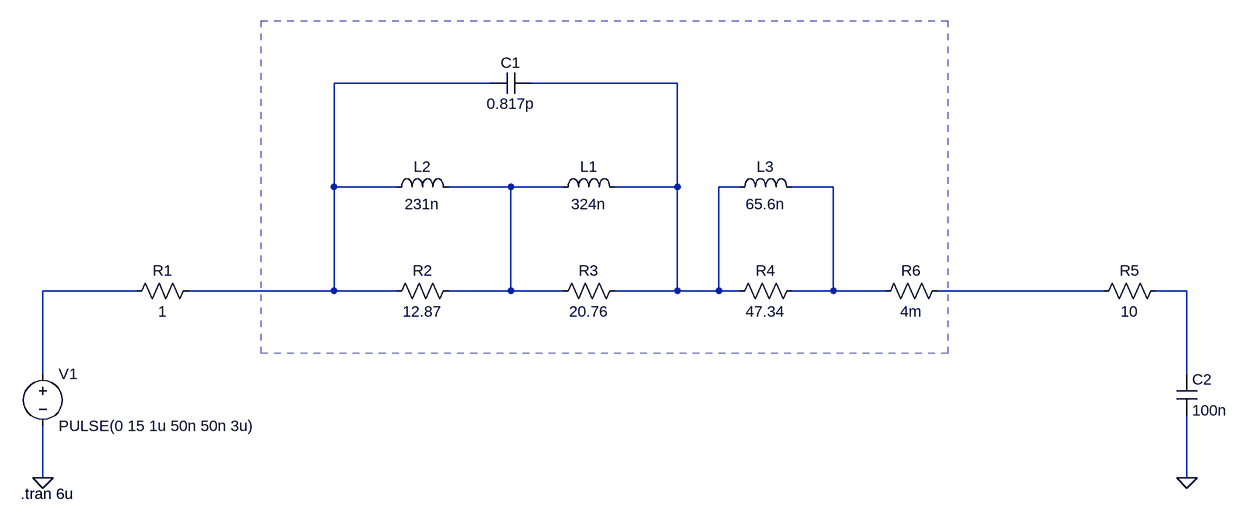
[diagram p0: schematic BLM41PG600SN1.asc]
BLM41PG600SN1.asc, the LTspice schematic file:
Version 4
SHEET 1 1640 680
WIRE 496 -304 256 -304
WIRE 784 -304 560 -304
WIRE 256 -144 256 -304
WIRE 352 -144 256 -144
WIRE 528 -144 432 -144
WIRE 608 -144 528 -144
WIRE 784 -144 784 -304
WIRE 784 -144 688 -144
WIRE 880 -144 848 -144
WIRE 1024 -144 960 -144
WIRE -48 16 -192 16
WIRE 256 16 256 -144
WIRE 256 16 32 16
WIRE 352 16 256 16
WIRE 528 16 528 -144
WIRE 528 16 432 16
WIRE 608 16 528 16
WIRE 784 16 784 -144
WIRE 784 16 688 16
WIRE 848 16 848 -144
WIRE 848 16 784 16
WIRE 880 16 848 16
WIRE 1024 16 1024 -144
WIRE 1024 16 960 16
WIRE 1104 16 1024 16
WIRE 1440 16 1184 16
WIRE 1568 16 1520 16
WIRE -192 144 -192 16
WIRE 1568 144 1568 16
WIRE -192 304 -192 224
WIRE 1568 304 1568 208
FLAG -192 304 0
FLAG 1568 304 0
SYMBOL voltage -192 128 R0
WINDOW 123 0 0 Left 0
WINDOW 39 0 0 Left 0
SYMATTR InstName V1
SYMATTR Value PULSE(0 15 1u 50n 50n 3u)
SYMBOL res 48 0 R90
WINDOW 0 0 56 VBottom 2
WINDOW 3 32 56 VTop 2
SYMATTR InstName R1
SYMATTR Value 1
SYMBOL ind 336 -128 R270
WINDOW 0 32 56 VTop 2
WINDOW 3 5 56 VBottom 2
SYMATTR InstName L2
SYMATTR Value 231n
SYMBOL res 448 0 R90
WINDOW 0 0 56 VBottom 2
WINDOW 3 32 56 VTop 2
SYMATTR InstName R2
SYMATTR Value 12.87
SYMBOL res 704 0 R90
WINDOW 0 0 56 VBottom 2
WINDOW 3 32 56 VTop 2
SYMATTR InstName R3
SYMATTR Value 20.76
SYMBOL ind 592 -128 R270
WINDOW 0 32 56 VTop 2
WINDOW 3 5 56 VBottom 2
SYMATTR InstName L1
SYMATTR Value 324n
SYMBOL res 864 32 R270
WINDOW 0 32 56 VTop 2
WINDOW 3 0 56 VBottom 2
SYMATTR InstName R4
SYMATTR Value 47.34
SYMBOL ind 864 -128 R270
WINDOW 0 32 56 VTop 2
WINDOW 3 5 56 VBottom 2
SYMATTR InstName L3
SYMATTR Value 65.6n
SYMBOL cap 560 -320 R90
WINDOW 0 0 32 VBottom 2
WINDOW 3 32 32 VTop 2
SYMATTR InstName C1
SYMATTR Value 0.817p
SYMBOL res 1536 0 R90
WINDOW 0 0 56 VBottom 2
WINDOW 3 32 56 VTop 2
SYMATTR InstName R5
SYMATTR Value 10
SYMBOL cap 1552 144 R0
SYMATTR InstName C2
SYMATTR Value 100n
SYMBOL res 1200 0 R90
WINDOW 0 0 56 VBottom 2
WINDOW 3 32 56 VTop 2
SYMATTR InstName R6
SYMATTR Value 4m
TEXT -226 328 Left 2 !.tran 6u
RECTANGLE Normal 1200 112 144 -400 2

The netlist it stands for:
* BLM41PG600SN1.asc
V1 N005 0 PULSE(0 15 1u 50n 50n 3u)
R1 N001 N005 1
L2 N001 N003 231n
R2 N003 N001 12.87
R3 N002 N003 20.76
L1 N003 N002 324n
R4 N002 N004 47.34
L3 N002 N004 65.6n
C1 N002 N001 0.817p
R5 N007 N006 10
C2 N007 0 100n
R6 N006 N004 4m
.tran 6u
.backanno
.end